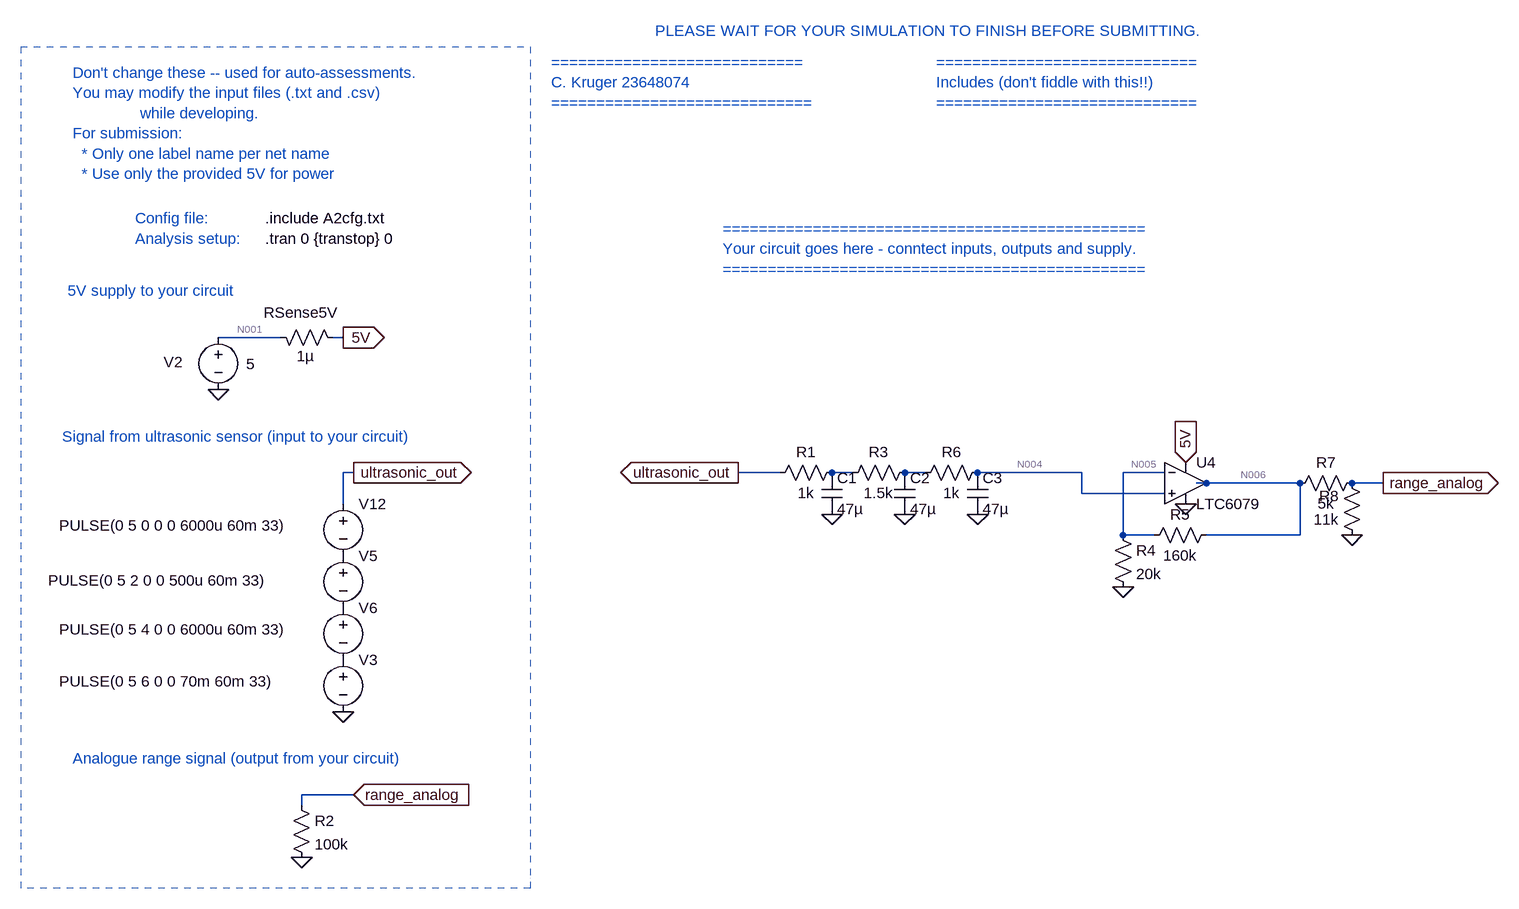
[diagram p0: schematic E344_23648074_A2.asc]
E344_23648074_A2.asc, the LTspice schematic file:
Version 4
SHEET 1 3140 2124
WIRE -1968 -976 -2064 -976
WIRE -1872 -976 -1888 -976
WIRE -1856 -768 -1872 -768
WIRE -1200 -768 -1264 -768
WIRE -1088 -768 -1120 -768
WIRE -976 -768 -1008 -768
WIRE -736 -768 -896 -768
WIRE -608 -768 -672 -768
WIRE -544 -752 -560 -752
WIRE -400 -752 -544 -752
WIRE -272 -752 -320 -752
WIRE -736 -736 -736 -768
WIRE -608 -736 -736 -736
WIRE -1872 -720 -1872 -768
WIRE -672 -672 -672 -768
WIRE -624 -672 -672 -672
WIRE -400 -672 -400 -752
WIRE -400 -672 -544 -672
WIRE -1856 -272 -1936 -272
WIRE -1936 -256 -1936 -272
FLAG -1872 -976 5V
IOPIN -1872 -976 Out
FLAG -2064 -896 0
FLAG -576 -784 5V
IOPIN -576 -784 In
FLAG -1872 -400 0
FLAG -1856 -768 ultrasonic_out
IOPIN -1856 -768 Out
FLAG -1264 -768 ultrasonic_out
IOPIN -1264 -768 Out
FLAG -272 -752 range_analog
IOPIN -272 -752 Out
FLAG -1856 -272 range_analog
IOPIN -1856 -272 In
FLAG -1936 -176 0
FLAG -576 -720 0
FLAG -1120 -704 0
FLAG -1008 -704 0
FLAG -672 -592 0
FLAG -896 -704 0
FLAG -320 -672 0
SYMBOL voltage -2064 -992 R0
WINDOW 123 0 0 Left 0
WINDOW 39 0 0 Left 0
WINDOW 0 -84 54 Left 2
WINDOW 3 43 57 Left 2
SYMATTR InstName V2
SYMATTR Value 5
SYMBOL res -1984 -992 M90
WINDOW 0 -7 47 VBottom 2
WINDOW 3 29 54 VTop 2
SYMATTR InstName RSense5V
SYMATTR Value 1µ
SYMBOL Opamps\\LTC6079 -576 -752 R0
SYMATTR InstName U4
SYMBOL voltage -1872 -736 R0
WINDOW 123 0 0 Left 0
WINDOW 39 0 0 Left 0
WINDOW 3 -437 49 Left 2
SYMATTR Value PULSE(0 5 0 0 0 6000u 60m 33)
SYMATTR InstName V12
SYMBOL voltage -1872 -656 R0
WINDOW 123 0 0 Left 0
WINDOW 39 0 0 Left 0
WINDOW 3 -454 54 Left 2
SYMATTR Value PULSE(0 5 2 0 0 500u 60m 33)
SYMATTR InstName V5
SYMBOL voltage -1872 -576 R0
WINDOW 123 0 0 Left 0
WINDOW 39 0 0 Left 0
WINDOW 3 -437 49 Left 2
SYMATTR Value PULSE(0 5 4 0 0 6000u 60m 33)
SYMATTR InstName V6
SYMBOL voltage -1872 -496 R0
WINDOW 123 0 0 Left 0
WINDOW 39 0 0 Left 0
WINDOW 3 -437 49 Left 2
SYMATTR Value PULSE(0 5 6 0 0 70m 60m 33)
SYMATTR InstName V3
SYMBOL res -1952 -272 R0
SYMATTR InstName R2
SYMATTR Value 100k
SYMBOL res -1104 -784 R90
WINDOW 0 0 56 VBottom 2
WINDOW 3 32 56 VTop 2
SYMATTR InstName R1
SYMATTR Value 1k
SYMBOL res -992 -784 R90
WINDOW 0 0 56 VBottom 2
WINDOW 3 32 56 VTop 2
SYMATTR InstName R3
SYMATTR Value 1.5k
SYMBOL cap -1136 -768 R0
SYMATTR InstName C1
SYMATTR Value 47µ
SYMBOL cap -1024 -768 R0
SYMATTR InstName C2
SYMATTR Value 47µ
SYMBOL res -688 -688 R0
SYMATTR InstName R4
SYMATTR Value 20k
SYMBOL res -528 -688 R90
WINDOW 0 0 56 VBottom 2
WINDOW 3 32 56 VTop 2
SYMATTR InstName R5
SYMATTR Value 160k
SYMBOL cap -912 -768 R0
SYMATTR InstName C3
SYMATTR Value 47µ
SYMBOL res -880 -784 R90
WINDOW 0 0 56 VBottom 2
WINDOW 3 32 56 VTop 2
SYMATTR InstName R6
SYMATTR Value 1k
SYMBOL res -304 -768 R90
WINDOW 0 0 56 VBottom 2
WINDOW 3 32 56 VTop 2
SYMATTR InstName R7
SYMATTR Value 5k
SYMBOL res -304 -656 R180
WINDOW 0 36 76 Left 2
WINDOW 3 36 40 Left 2
SYMATTR InstName R8
SYMATTR Value 11k
TEXT -1992 -1128 Left 2 !.tran 0 {transtop} 0
TEXT -1992 -1160 Left 2 !.include A2cfg.txt
TEXT -2288 -1384 Left 2 ;Don't change these -- used for auto-assessments.\nYou may modify the input files (.txt and .csv) \n               while developing.\nFor submission: \n  * Only one label name per net name\n  * Use only the provided 5V for power
TEXT -2192 -1160 Left 2 ;Config file:
TEXT -2192 -1128 Left 2 ;Analysis setup:
TEXT -1552 -1400 Left 2 ;============================\nC. Kruger 23648074\n=============================
TEXT -960 -1400 Left 2 ;=============================\nIncludes (don't fiddle with this!!)\n=============================
TEXT -1288 -1144 Left 2 ;===============================================\nYour circuit goes here - conntect inputs, outputs and supply.\n===============================================
TEXT -1392 -1448 Left 2 ;PLEASE WAIT FOR YOUR SIMULATION TO FINISH BEFORE SUBMITTING.
TEXT -2304 -824 Left 2 ;Signal from ultrasonic sensor (input to your circuit)
TEXT -2296 -1048 Left 2 ;5V supply to your circuit
TEXT -2288 -328 Left 2 ;Analogue range signal (output from your circuit)
LINE Normal -1584 -1424 -1584 -128 2
LINE Normal -2368 -1424 -1584 -1424 2
LINE Normal -1584 -128 -2368 -128 2
LINE Normal -1584 -144 -1584 -144 2
LINE Normal -2368 -1424 -2368 -128 2

The netlist it stands for:
* E344_23648074_A2.asc
V2 N001 0 5
RSense5V N001 5V 1µ
XU4 N004 N005 5V 0 N006 LTC6078  ; LTC6079, pins In+ In- V+ V- OUT
V12 ultrasonic_out P001 PULSE(0 5 0 0 0 6000u 60m 33)
V5 P001 P002 PULSE(0 5 2 0 0 500u 60m 33)
V6 P002 P003 PULSE(0 5 4 0 0 6000u 60m 33)
V3 P003 0 PULSE(0 5 6 0 0 70m 60m 33)
R2 range_analog 0 100k
R1 N002 ultrasonic_out 1k
R3 N003 N002 1.5k
C1 N002 0 47µ
C2 N003 0 47µ
R4 N005 0 20k
R5 N006 N005 160k
C3 N004 0 47µ
R6 N004 N003 1k
R7 range_analog N006 5k
R8 0 range_analog 11k
.tran 0 {transtop} 0
.include A2cfg.txt
* Don't change these -- used for auto-assessments.
* You may modify the input files (.txt and .csv)
*                while developing.
* For submission:
*   * Only one label name per net name
*   * Use only the provided 5V for power
* Config file:
* Analysis setup:
* ============================
* C. Kruger 23648074
* =============================
* =============================
* Includes (don't fiddle with this!!)
* =============================
* ===============================================
* Your circuit goes here - conntect inputs, outputs and supply.
* ===============================================
* PLEASE WAIT FOR YOUR SIMULATION TO FINISH BEFORE SUBMITTING.
* Signal from ultrasonic sensor (input to your circuit)
* 5V supply to your circuit
* Analogue range signal (output from your circuit)
.lib LTC5.lib
.backanno
.end

* Results of the author's LTspice run, read from the files saved beside the schematic
* Operating Point, zero values left out:
*   V(n001) = 5 V
*   V(5v) = 5 V
*   V(n004) = 5.985 nV
*   V(n005) = 6.773 µV
*   V(n006) = 60.68 µV
*   V(range_analog) = 40.33 µV
*   I(R8) = -3.667 nA
*   I(R7) = -4.07 nA
*   I(R6) = 1.71 pA
*   I(R5) = 336.9 pA
*   I(R4) = 338.6 pA
*   I(R3) = 1.71 pA
*   I(R1) = 1.71 pA
*   I(R2) = 403.3 pA
*   I(Rsense5v) = 36.04 µA
*   I(V3) = 1.71 pA
*   I(V6) = 1.71 pA
*   I(V5) = 1.71 pA
*   I(V12) = 1.71 pA
*   I(V2) = -36.04 µA
*   Ix(u4:1) = -1.71 pA
*   Ix(u4:2) = -1.71 pA
*   Ix(u4:3) = 36.04 µA
*   Ix(u4:4) = -36.03 µA
*   Ix(u4:5) = -4.402 nA
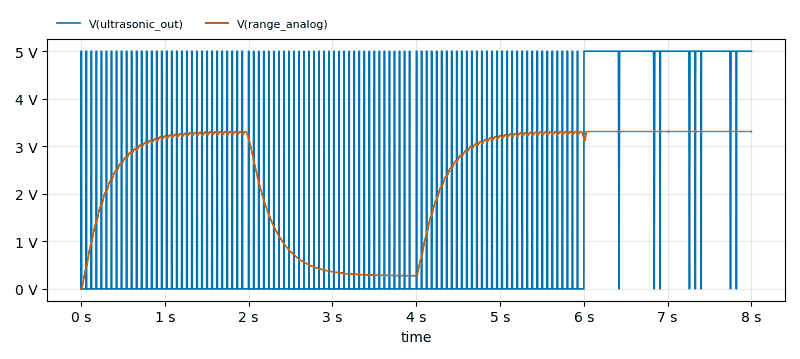
[diagram p1: Transient Analysis of E344_23648074_A2.asc, plotted from the saved traces]
* Transient Analysis, 1 run:
*   V(ultrasonic_out): min 0 V, max 5 V, average 1.507 V, rms 2.738 V, last 5 V
*   V(range_analog): min 40.33 µV, max 3.312 V, average 2.407 V, rms 2.686 V, last 3.311 V